# Altium schematic sheet STM32.SchDoc
size A
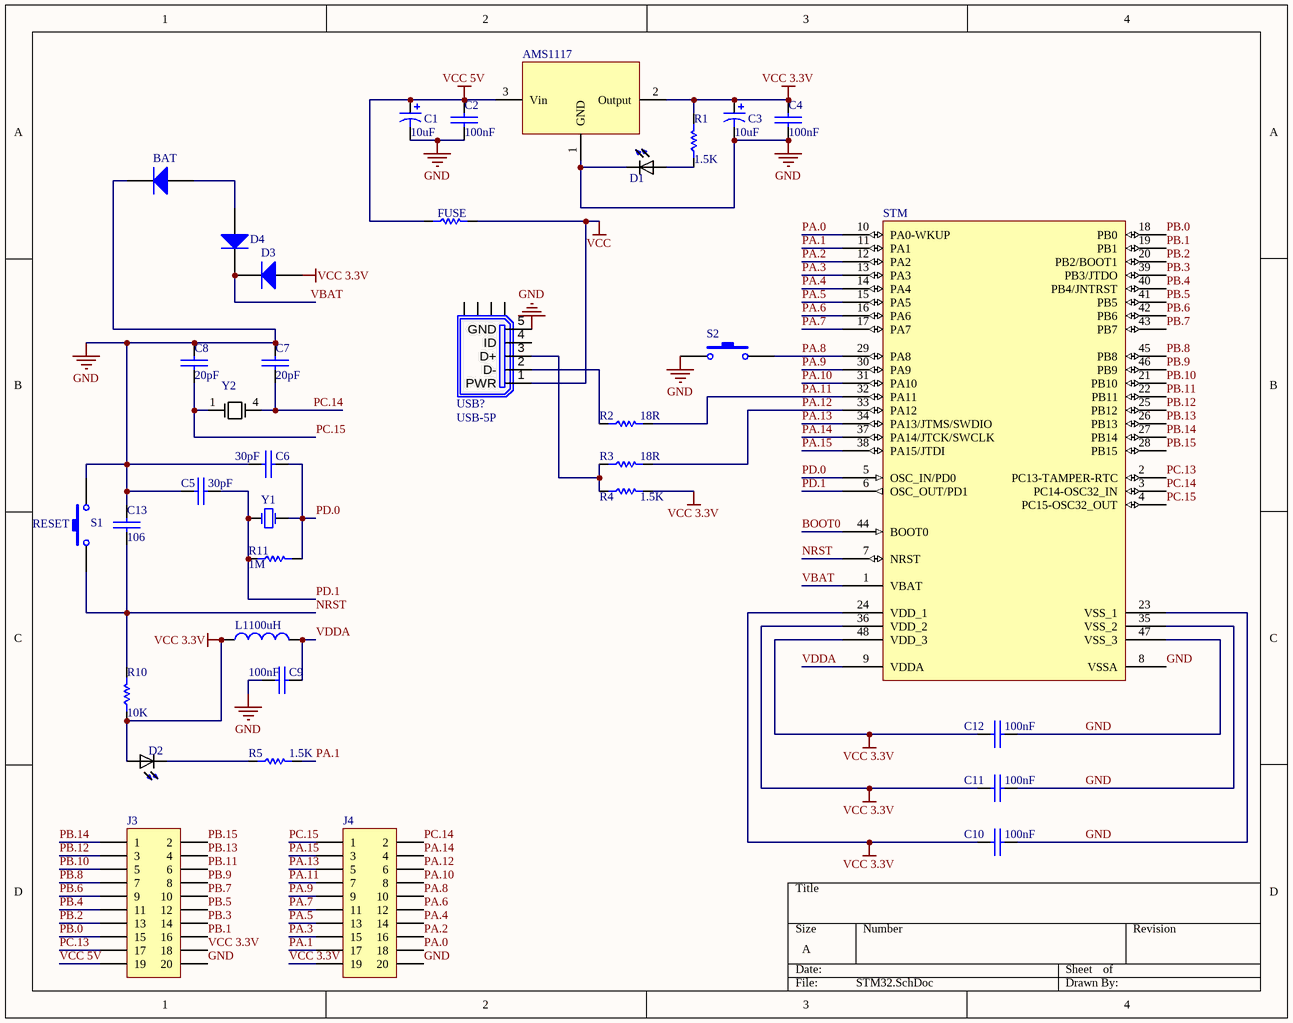
[diagram p0: STM32.SchDoc]

## Parts
AMS1117  AMS1117  [AMS1117 3.3]  (value not drawn)
BAT  1N4148  [LL4148]  (value not drawn)
C1  value 10uF  [A]  (hidden comment: T491A)
C2  100nF  [SMD_CAP_0805]
C3  value 10uF  [A]  (hidden comment: T491A)
C4  100nF  [SMD_CAP_0805]
C5  30pF  [SMD_CAP_0805]
C6  30pF  [SMD_CAP_0805]
C7  20pF  [SMD_CAP_0805]
C8  20pF  [SMD_CAP_0805]
C9  100nF  [SMD_CAP_0805]
C10  100nF  [SMD_CAP_0805]
C11  100nF  [SMD_CAP_0805]
C12  100nF  [SMD_CAP_0805]
C13  106  [SMD_CAP_0805]
D1  LSR976  [*0805_R_LSR976(Primary)]  (value not drawn)
D2  LSR976  [*0805_R_LSR976(Primary)]  (value not drawn)
D3  1N4148  [LL4148]  (value not drawn)
D4  1N4148  [LL4148]  (value not drawn)
FUSE  18R  [SMD_RES_0805]  (value not drawn)
J3  Header 10X2  [HDR2X10]  (value not drawn)
J4  Header 10X2  [HDR2X10]  (value not drawn)
L1100uH  Inductor  [INDC3216]  (value not drawn)
R1  1.5K  [SMD_RES_0805]
R2  18R  [SMD_RES_0805]
R3  18R  [SMD_RES_0805]
R4  1.5K  [SMD_RES_0805]
R5  1.5K  [SMD_RES_0805]
R10  10K  [SMD_RES_0805]
R11  1M  [SMD_RES_0805]
S1  RESET  [SW-PB]
S2  Switch PB  [SW-PB]  (value not drawn)
STM  STM32F103C8T6  [LQFP48_N]  (value not drawn)
USB?  USB-5P  [USB-Micro_B/4legs]
Y1  12 MHz  [Crystal SMD]  (value not drawn)
Y2  ABS25-32.768KHZ-6-T  [*XTAL_ABS25-32.768KHZ-6-T]  (value not drawn)

## Nets
GND: AMS1117.1(GND) BAT.2(K) C1.2 C2.2(-) C3.2 C4.2(-) C5.2(-) C6.2(-) C7.1(+) C8.1(+) C9.2(-) C10.2(-) C11.2(-) C12.1(+) C13.1(+) D1.C J3.20 J4.20 S1.2 S2.1 STM.8(VSSA) STM.23(VSS_1) STM.35(VSS_2) STM.47(VSS_3) USB?.5(SHIELD)
VCC: FUSE.2 USB?.1(PWR)
VCC 3.3V: AMS1117.2(Output) C3.1 C4.1(+) C10.1(+) C11.1(+) C12.2(-) D2.A D3.1(A) J3.18 J4.19 L1100uH.1 R1.2 R4.2 R10.1 STM.24(VDD_1) STM.36(VDD_2) STM.48(VDD_3)
VCC 5V: AMS1117.3(Vin) C1.1 C2.1(+) FUSE.1 J3.19
BOOT0: STM.44(BOOT0)
NRST: C13.2(-) R10.2 S1.1 STM.7(NRST)
PA.0: J4.18 STM.10(PA0-WKUP)
PA.1: J4.17 R5.2 STM.11(PA1)
PA.2: J4.16 STM.12(PA2)
PA.3: J4.15 STM.13(PA3)
PA.4: J4.14 STM.14(PA4)
PA.5: J4.13 STM.15(PA5)
PA.6: J4.12 STM.16(PA6)
PA.7: J4.11 STM.17(PA7)
PA.8: J4.10 S2.2 STM.29(PA8)
PA.9: J4.9 STM.30(PA9)
PA.10: J4.8 STM.31(PA10)
PA.11: J4.7 R2.2 STM.32(PA11)
PA.12: J4.6 R3.2 STM.33(PA12)
PA.13: J4.5 STM.34(PA13/JTMS/SWDIO)
PA.14: J4.4 STM.37(PA14/JTCK/SWCLK)
PA.15: J4.3 STM.38(PA15/JTDI)
PB.0: J3.15 STM.18(PB0)
PB.1: J3.16 STM.19(PB1)
PB.2: J3.13 STM.20(PB2/BOOT1)
PB.3: J3.14 STM.39(PB3/JTDO)
PB.4: J3.11 STM.40(PB4/JNTRST)
PB.5: J3.12 STM.41(PB5)
PB.6: J3.9 STM.42(PB6)
PB.7: J3.10 STM.43(PB7)
PB.8: J3.7 STM.45(PB8)
PB.9: J3.8 STM.46(PB9)
PB.10: J3.5 STM.21(PB10)
PB.11: J3.6 STM.22(PB11)
PB.12: J3.3 STM.25(PB12)
PB.13: J3.4 STM.26(PB13)
PB.14: J3.1 STM.27(PB14)
PB.15: J3.2 STM.28(PB15)
PC.13: J3.17 STM.2(PC13-TAMPER-RTC)
PC.14: C7.2(-) J4.2 STM.3(PC14-OSC32_IN) Y2.4
PC.15: C8.2(-) J4.1 STM.4(PC15-OSC32_OUT) Y2.1
PD.0: C6.1(+) R11.2 STM.5(OSC_IN/PD0) Y1.2(OSC2)
PD.1: C5.1(+) R11.1 STM.6(OSC_OUT/PD1) Y1.1(OSC1)
VBAT: D3.2(K) D4.2(K) STM.1(VBAT)
VDDA: C9.1(+) L1100uH.2 STM.9(VDDA)
NetBAT_1: BAT.1(A) D4.1(A)
NetD1_A: D1.A R1.1
NetD2_C: D2.C R5.1
NetR2_1: R2.1 USB?.2(D-)
NetR3_1: R3.1 R4.1 USB?.3(D+)

Not connected (* = marked no-connect by the designer): USB? 4(ID)

## Library data of the parts
BAT D3 D4 = Diode 1N4148: High Conductance Fast Diode; Published: 8-Jun-2000; LatestRevisionDate: 17-Jul-2002; LatestRevisionNote: Re-released for DXP Platform.; DatasheetVersion: 1997; PackageReference: DO-35; Publisher: Altium Limited; PackageDescription: Diode, Axial; Body 3.8 x 1.9 mm (LxDia. max), Lead Dia. 0.53 mm (max); Code_JEDEC: DO-204-AH; ComponentLink1Description: Manufacturer Link; ComponentLink1URL: http://www.fairchildsemi.com/; ComponentLink2Description: Datasheet; ComponentLink2URL: http://www.fairchildsemi.com/ds/1N%2F1N4148.pdf
C1 C3 = T491A: Solid Tantalum Chip Capacitor, Standard T491 Series - Industrial Grade; Published: 17-Jul-2002; LatestRevisionDate: 19-Mar-2004; LatestRevisionNote: Silkscreen dimensions re-sized.; DatasheetDocument: Mar-2001; PackageDocument: Mar-2001; PackageReference: A; Publisher: Altium Limited; Code_JEITA: 3216-18; ComponentLink1Description: Manufacturer Link; ComponentLink1URL: http://www.kemet.com/; ComponentLink2Description: Datasheet; ComponentLink2URL: http://www.kemet.com/kemet/web/homepage/kechome.nsf/vapubfilesname/F3102TA.pdf/$file/F3102TA.pdf
C2 C4-C13 = Cap-Bipolar: Bipolar Capacitor; Voltage: 100V; Designer: Saeid Jorablo; Organazation: ControTec; Adding Date: 1387/12/20
  C2 C4 C9-C12: Value: 100nF
  C5 C6: Value: 30pF
  C7 C8: Value: 20pF
  C13: Value: 106
D1 D2 = LSR976: SMD LED [Osram Semiconductors] LSR976 SMD LED; MF: OSRAM Opto; Availability: Unavailable; Price: None; SnapEDA_Link: https://www.snapeda.com/parts/LSR976/OSRAM%20Opto%20Semiconductors%20Inc./view-part/?ref=snap; MP: LSR976; Package: 0805 Osram; Value: *
FUSE R1-R5 R11 = Resistor: Tolerance: 5%; Power: 1/8 W
  FUSE R2 R3: Value: 18R
  R1 R4 R5: Value: 1.5K
  R11: Value: 1M
J3 J4 = Header 10X2: Header, 10-Pin, Dual row; LatestRevisionDate: 17-Jul-2002; LatestRevisionNote: Re-released for DXP Platform.; Publisher: Altium Limited
L1100uH = Inductor: Code_IEC: 1005; Value: 10mH; Published: 8-Jun-2000; LatestRevisionDate: 29-May-2009; LatestRevisionNote: IPC-7351 Footprint Added.; PackageReference: 0402-A; Publisher: Altium Limited; PackageDescription: Chip Inductor; Code_JEITA: 0402
R10 = Resistor: Tolerance: 9; Power: 1/8 W; Value: 10K
S1 S2 = Switch PB: Push Button Switch
STM = STM32F103C8T6: STM32 ARM-based 32-bit MCU with 64 Kbytes Flash, 48-pin LQFP, Industrial Temperature; Published: 30-May-2008; DatasheetVersion: rev6, Mar-2008; PackageVersion: Mar-2008; PackageReference: LQFP48; Publisher: Altium Limited; PackageDescription: 48-Pin Low-Profile Quad Flat Pack, 7 x 7 mm Body, 0.5 mm Pitch (LQFP48); ComponentLink1Description: Manufacturer Link; ComponentLink1URL: www.st.com/stm32; ComponentLink2Description: Datasheet; ComponentLink2URL: http://www.st.com/stonline/products/literature/ds/13587.pdf
USB? = USB-5P: Micro & Mini USB female; BOM名称: 微型USB母座; 版权归属: 源创客; 学习资源: www.ooocke.com
Y1 = XTAL: XTAL Crystal; Designer: ABBAS BASEREH; Design Date: 2017-1-3; ComponentLink1Description: Datasheet; ComponentLink2Description: Reference; Mounting Technology: Surface Mount\Through-Hole; Value: 12 MHz; Status: Unreleased
Y2 = ABS25-32.768KHZ-6-T: ABS25 Series 32.768 kHz Â±20 ppm 6 pF -40 to +85 Â°C SMT Low Frequency Crystal; MF: Abracon; MP: ABS25-32.768KHZ-6-T; Package: 4-4 Abracon; Price: None; SnapEDA_Link: https://www.snapeda.com/parts/ABS25-32.768KHZ-6-T/Abracon%20LLC/view-part/?ref=snap; Availability: Unavailable; Value: *